# EAGLE design Battery board V4.2 (EAGLE 8.3.1)
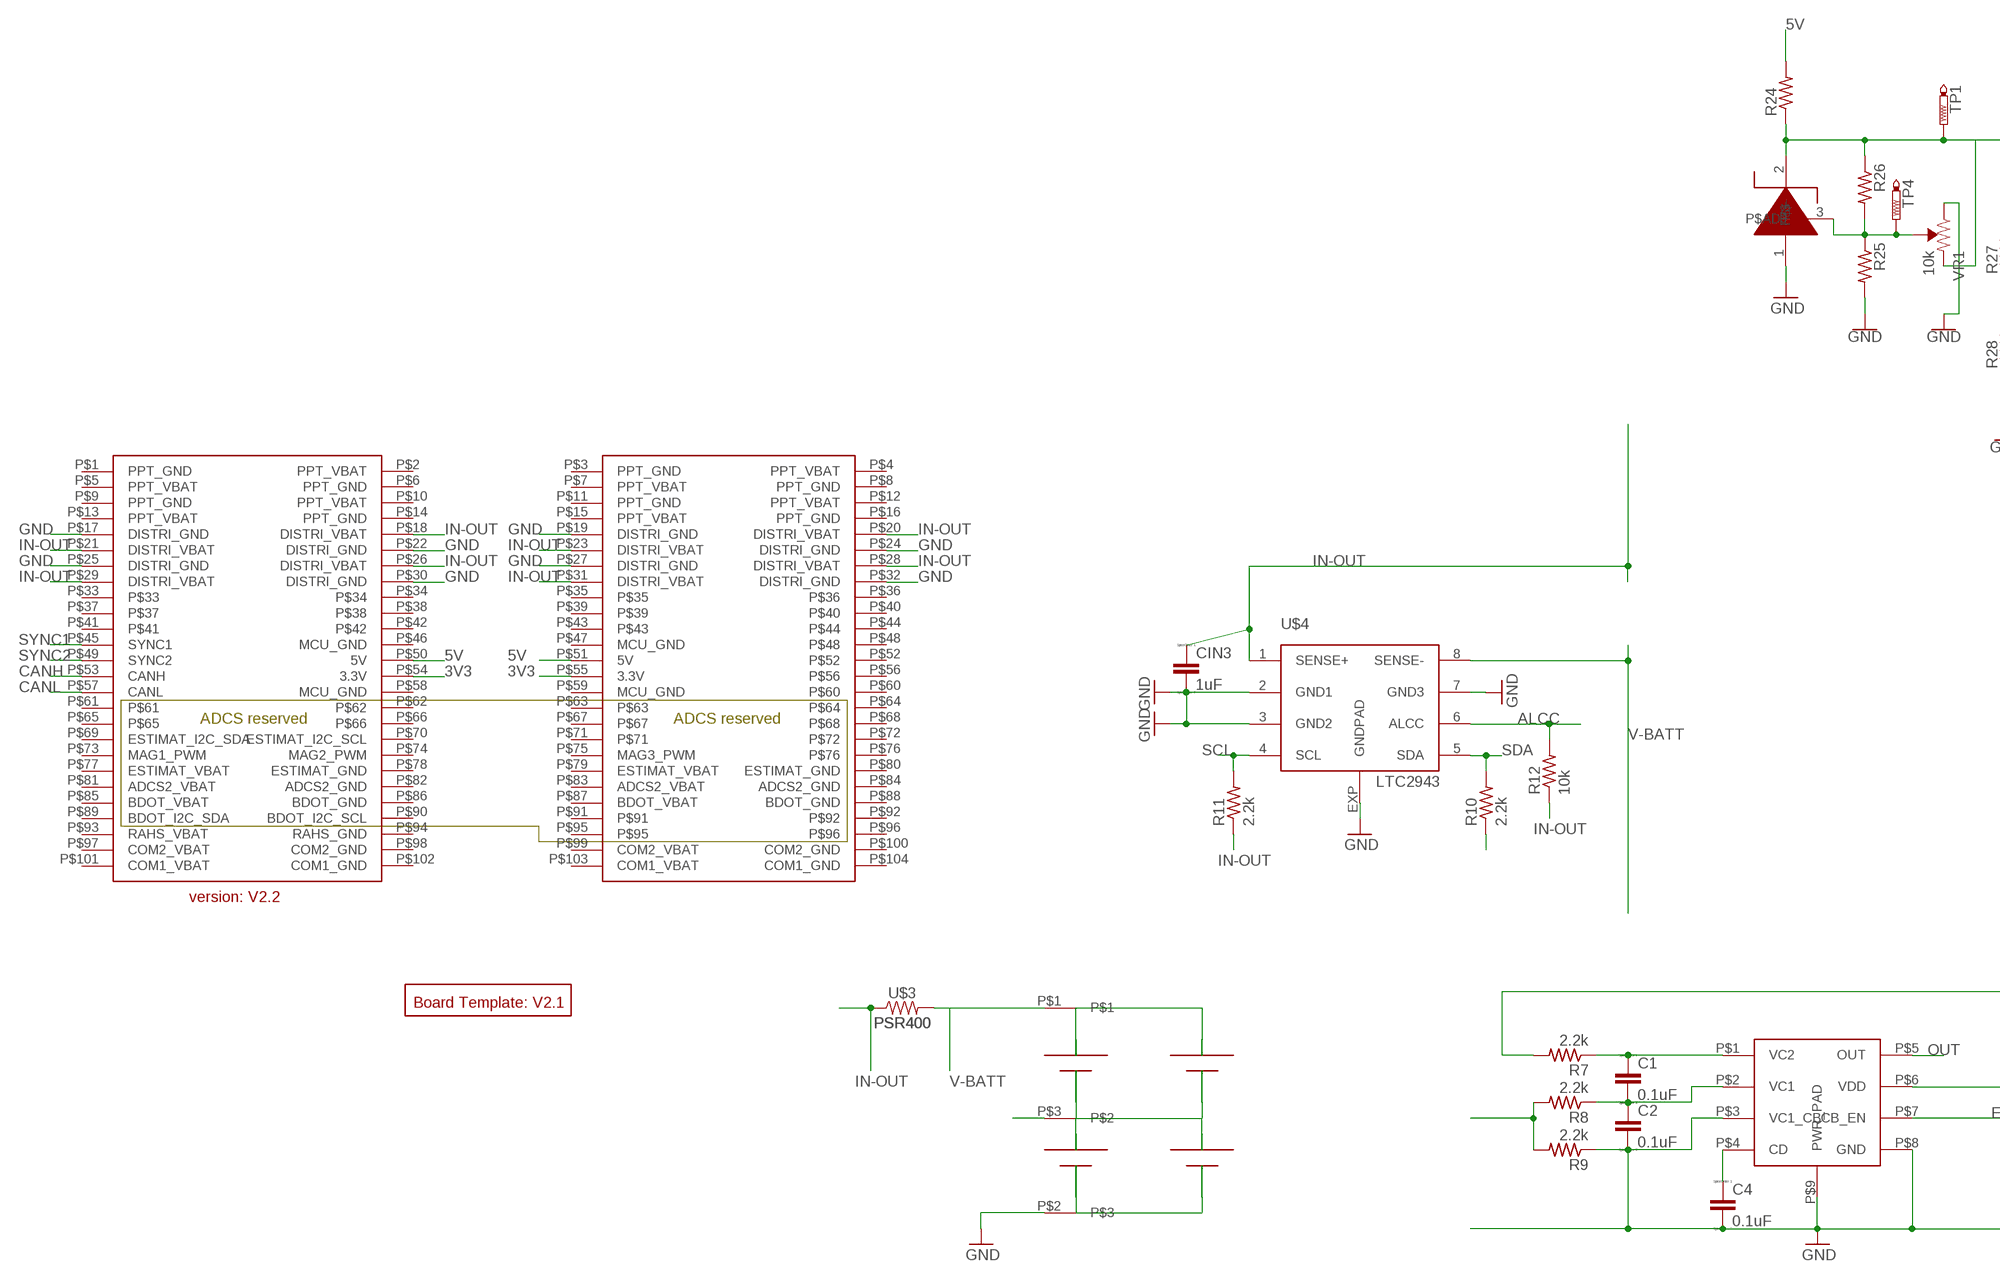
[diagram p0: schematic, sheet 1, part 1 of 2]
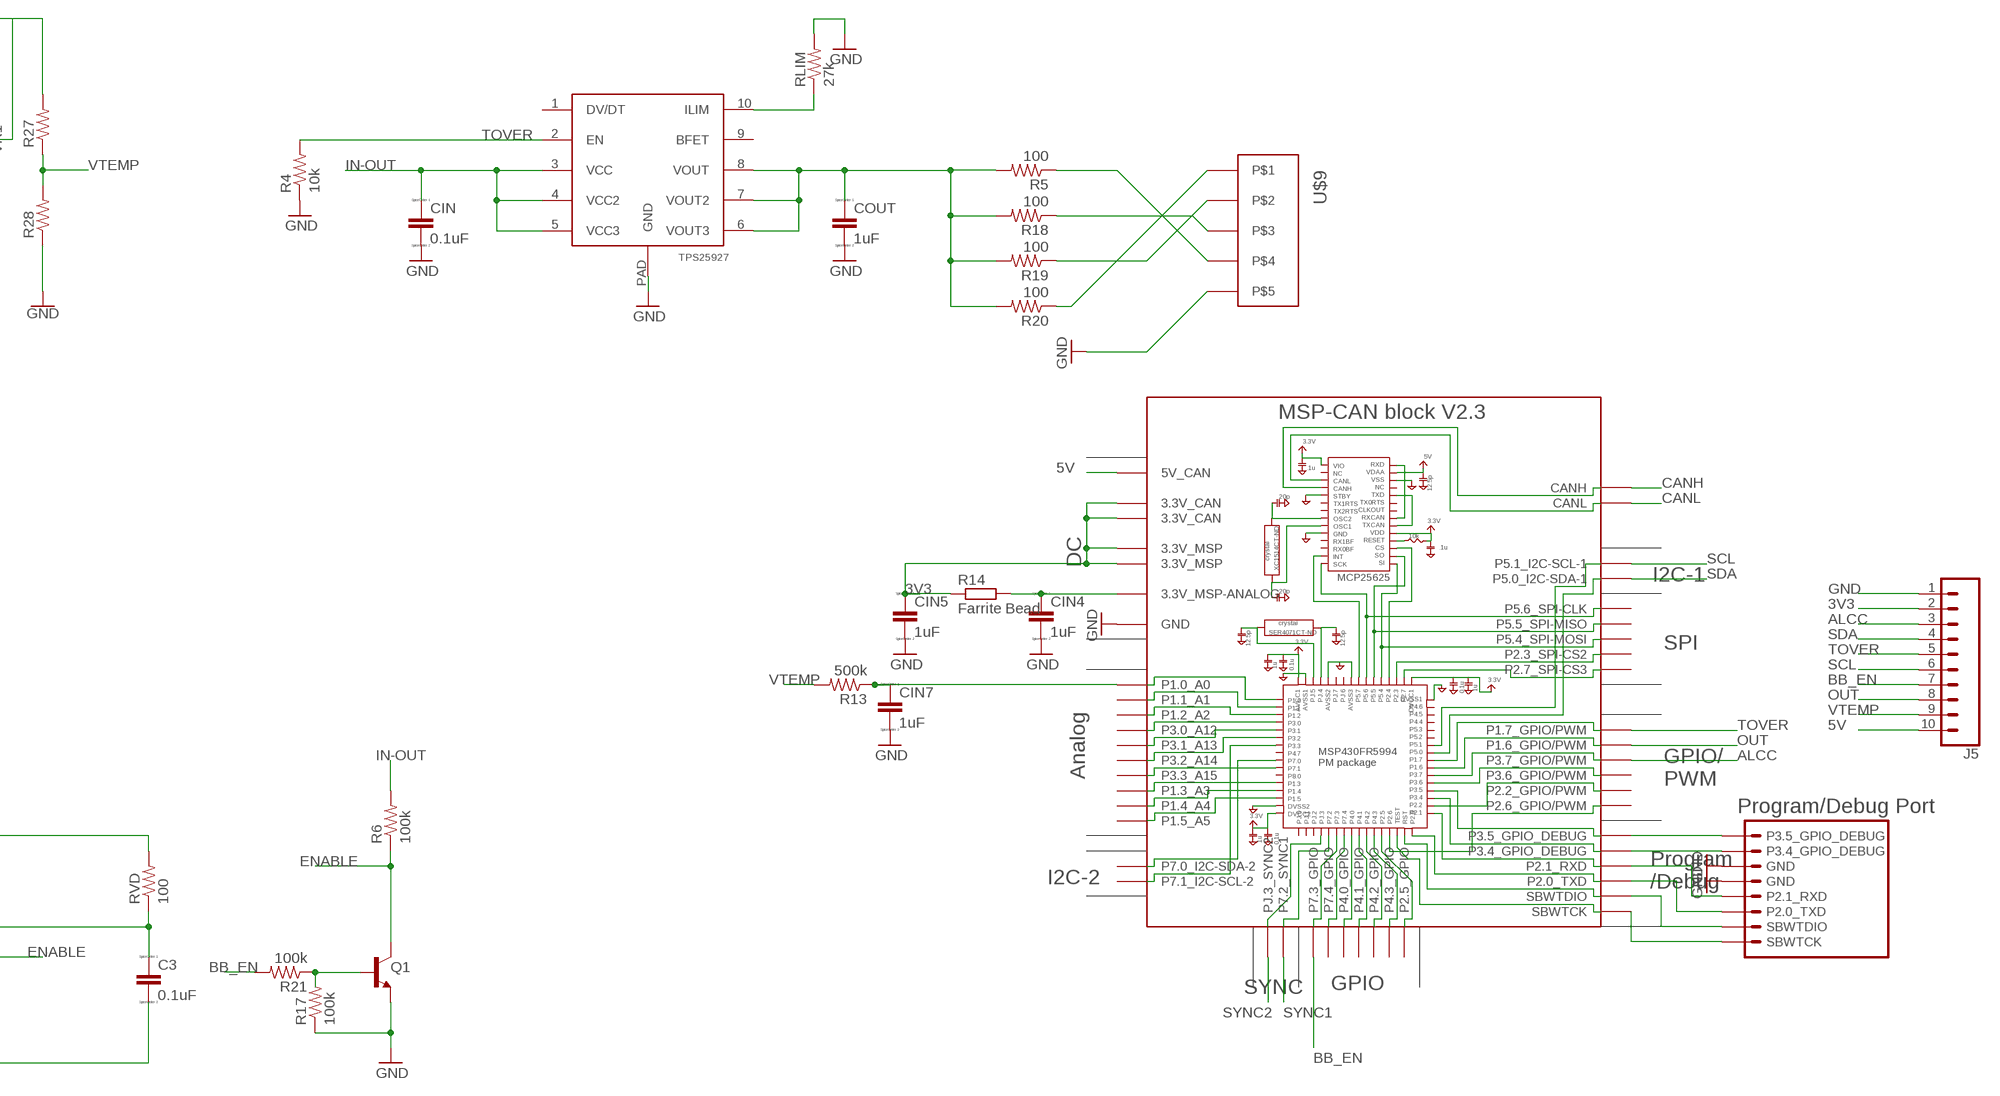
[diagram p1: schematic, sheet 1, part 2 of 2]

## Parts
C1  0.1uF  C  [C0805]
C2  0.1uF  C  [C0805]
C3  0.1uF  C  [C0805]
C4  0.1uF  C  [C0805]
CIN  0.1uF  C  [C0805]
CIN3  1uF  C  [C0805]
CIN4  1uF  C  [C0805]
CIN5  1uF  C  [C0805]
CIN7  1uF  C  [C0805]
COUT  1uF  C  [C0805]
J5  CONN_10LOCK  [1X10_LOCK]
Q1  TRANS_NPN-MMBT2222AL  [SOT23-3]
R4  10k  R-US_R0805  [R0805]
R5  100  R-US_R0805  [R0805]
R6  100k  R-US_R0805  [R0805]
R7  2.2k  R-US_R0805  [R0805]
R8  2.2k  R-US_R0805  [R0805]
R9  2.2k  R-US_R0805  [R0805]
R10  2.2k  R-US_R0805  [R0805]
R11  2.2k  R-US_R0805  [R0805]
R12  10k  R-US_R0805  [R0805]
R13  500k  R-US_R0805  [R0805]
R14  Farrite Bead  R-EU_R1206  [R1206]
R17  100k  R-US_M0805  [M0805]
R18  100  R-US_R0805  [R0805]
R19  100  R-US_R0805  [R0805]
R20  100  R-US_R0805  [R0805]
R21  100k  R-US_M0805  [M0805]
R24  R-US_R0805  [R0805]
R25  R-US_R0805  [R0805]
R26  R-US_R0805  [R0805]
R27  R-US_R0805  [R0805]
R28  R-US_R0805  [R0805]
RLIM  27k  R-US_R0805  [R0805]
RVD  100  R-US_R0805  [R0805]
TP1  PTR1PAD1-13Y  [P1-13Y]
TP4  PTR1PAD1-13Y  [P1-13Y]
U$1  MSP-CAN_BLOCK  [MSP-CAN_BLOCK]
U$2  PROGRAM/DEBUG_PORT  [1X08_CONNECTOR]
U$3  PSR400  [PSR400]
U$4  LTC2943  [DFN8(3X3)LT]
U$5  TPS252927  [VSON10]
U$6  POWER_PACK  [BATTERY_PACK]
U$7  PC104_CONNECTOR  [PC104_CONNECTOR]
U$8  BQ29209  [VSON8]
U$9  PICOLOCK_5  [PICOLOCK_5]
U$10  LM135Z  [TO-92-3]
U$11  BOARD_TEMPLATE  [BOARD_TEMPLATE]
VR1  10k  TRIMPOT-SMD-3MM-OPEN-1/10W-25%  [TRIMPOT-SMD-TC33X]

## Nets
3V3: CIN5.1 J5.2 R14.1 U$1.3.3V@CAN1(3.3V_CAN) U$1.3.3V@CAN2(3.3V_CAN) U$1.3.3V@MSP1(3.3V_MSP) U$1.3.3V@MSP2(3.3V_MSP) U$7.P$54(3.3V) U$7.P$55(3.3V)
5V: J5.10 R24.2 U$1.5V(5V_CAN) U$7.P$50(5V) U$7.P$51(5V)
ALCC: J5.3 R12.2 U$1.P3.7_GPIO/PWM U$4.6(ALCC)
BASE: Q1.1(B) R17.2 R21.1
BB_EN: J5.7 R21.2 U$1.P7.3_GPIO
BT-NODE: R8.2 R9.2 U$6.P$3
CANH: U$1.CANH U$7.P$53(CANH)
CANL: U$1.CANL U$7.P$57(CANL)
ENABLE: Q1.3(C) R6.1 U$8.P$7(CB_EN)
FERRITE-BEAD: CIN4.1 R14.2 U$1.3.3V_ANALOG@MSP2(3.3V_MSP-ANALOG)
GND: C2.2 C3.2 C4.2 CIN3.2 CIN4.2 CIN5.2 CIN7.2 CIN.2 COUT.2 J5.1 Q1.2(E) R4.1 R9.1 R17.1 R25.2 R28.1 RLIM.2 U$1.GND@1(GND) U$1.GND@2(GND) U$1.GND@3(GND) U$1.GND@4(GND) U$1.GND@5(GND) U$1.GND@7(GND) U$1.GND@8(GND) U$1.GND@9(GND) U$1.GND@10(GND) U$1.GND@11(GND) U$1.GND@12(GND) U$1.GND@13(GND) U$1.GND@14(GND) U$1.GND@15(GND) U$1.GND@16(GND) U$1.GND@17(GND) U$1.GND@26(GND) U$2.5(GND) U$2.6(GND) U$4.2(GND1) U$4.3(GND2) U$4.7(GND3) U$4.EXP(GNDPAD) U$5.PAD(GND) U$6.P$2 U$7.P$17(DISTRI_GND) U$7.P$19(DISTRI_GND) U$7.P$22(DISTRI_GND) U$7.P$24(DISTRI_GND) U$7.P$25(DISTRI_GND) U$7.P$27(DISTRI_GND) U$7.P$30(DISTRI_GND) U$7.P$32(DISTRI_GND) U$8.P$3(VC1_CB) U$8.P$8(GND) U$8.P$9(PWR_PAD) U$9.P$5 U$10.1(P$-) VR1.1(CW)
IN-OUT: CIN3.1 CIN.1 R6.2 R7.2 R10.1 R11.1 R12.1 RVD.2 U$3.P$1 U$4.1(SENSE+) U$5.3(VCC) U$5.4(VCC2) U$5.5(VCC3) U$7.P$18(DISTRI_VBAT) U$7.P$20(DISTRI_VBAT) U$7.P$21(DISTRI_VBAT) U$7.P$23(DISTRI_VBAT) U$7.P$26(DISTRI_VBAT) U$7.P$28(DISTRI_VBAT) U$7.P$29(DISTRI_VBAT) U$7.P$31(DISTRI_VBAT)
N$3: R20.1 U$9.P$1
N$4: C1.1 R7.1 U$8.P$1(VC2)
N$5: C1.2 C2.1 R8.1 U$8.P$2(VC1)
N$6: C3.1 RVD.1 U$8.P$6(VDD)
N$8: C4.1 U$8.P$4(CD)
N$9: COUT.1 R5.2 R18.2 R19.2 R20.2 U$5.6(VOUT3) U$5.7(VOUT2) U$5.8(VOUT)
N$10: RLIM.1 U$5.10(ILIM)
N$11: R19.1 U$9.P$2
N$12: R18.1 U$9.P$3
N$14: U$1.P3.5_GPIO_DEBUG U$2.8(P3.5_GPIO_DEBUG)
N$15: U$1.P3.4_GPIO_DEBUG U$2.7(P3.4_GPIO_DEBUG)
N$17: R5.1 U$9.P$4
N$19: U$1.P2.1_RXD U$2.4(P2.1_RXD)
N$20: U$1.P2.0_TXD U$2.3(P2.0_TXD)
N$21: U$1.SBWTDIO U$2.2(SBWTDIO)
N$22: U$1.SBWTCK U$2.SBWTCK
N$23: R24.1 R26.1 R27.2 TP1.TP U$10.2(P$+) VR1.3(CCW)
N$24: R25.1 R26.2 TP4.TP U$10.3(P$ADJ) VR1.2(WIPER)
OUT: J5.8 U$1.P1.6_GPIO/PWM U$8.P$5(OUT)
SCL: J5.6 R11.2 U$1.P5.1_I2C-SCL-1 U$4.4(SCL)
SDA: J5.4 R10.2 U$1.P5.0_I2C-SDA-1 U$4.5(SDA)
SYNC1: U$1.P7.2_SYNC1 U$7.P$45(SYNC1)
SYNC2: U$1.PJ.3_SYNC2 U$7.P$49(SYNC2)
TOVER: J5.5 R4.2 U$1.P1.7_GPIO/PWM U$5.2(EN)
V-BATT: U$3.P$2 U$4.8(SENSE-) U$6.P$1
VTEMP: J5.9 R13.2 R27.1 R28.2
VTEMP_FILTERED: CIN7.1 R13.1 U$1.P1.0_A0
Unconnected: U$1.P1.1_A1 U$1.P1.2_A2 U$1.P1.3_A3 U$1.P1.4_A4 U$1.P1.5_A5 U$1.P2.2_GPIO/PWM U$1.P2.4_SPI-CS2(P2.3_SPI-CS2) U$1.P2.5_GPIO U$1.P2.6_GPIO/PWM U$1.P2.7_SPI-CS3 U$1.P3.0_A12 U$1.P3.1_A13 U$1.P3.2_A14 U$1.P3.3_A15 U$1.P3.6_GPIO/PWM U$1.P4.0_GPIO U$1.P4.1_GPIO U$1.P4.2_GPIO U$1.P4.3_GPIO U$1.P5.4_SPI-MOSI U$1.P5.5_SPI-MISO U$1.P5.6_SPI-CLK U$1.P7.0_I2C-SDA-2 U$1.P7.1_I2C-SCL-2 U$1.P7.4_GPIO U$5.1(DV/DT) U$5.9(BFET) U$7.P$1(PPT_GND) U$7.P$2(PPT_VBAT) U$7.P$3(PPT_GND) U$7.P$4(PPT_VBAT) U$7.P$5(PPT_VBAT) U$7.P$6(PPT_GND) U$7.P$7(PPT_VBAT) U$7.P$8(PPT_GND) U$7.P$9(PPT_GND) U$7.P$10(PPT_VBAT) U$7.P$11(PPT_GND) U$7.P$12(PPT_VBAT) U$7.P$13(PPT_VBAT) U$7.P$14(PPT_GND) U$7.P$15(PPT_VBAT) U$7.P$16(PPT_GND) U$7.P$33 U$7.P$34 U$7.P$35 U$7.P$36 U$7.P$37 U$7.P$38 U$7.P$39 U$7.P$40 U$7.P$41 U$7.P$42 U$7.P$43 U$7.P$44 U$7.P$46(MCU_GND) U$7.P$47(MCU_GND) U$7.P$48 U$7.P$52 U$7.P$56 U$7.P$58(MCU_GND) U$7.P$59(MCU_GND) U$7.P$60 U$7.P$61 U$7.P$62 U$7.P$63 U$7.P$64 U$7.P$65 U$7.P$66 U$7.P$67 U$7.P$68 U$7.P$69(ESTIMAT_I2C_SDA) U$7.P$70(ESTIMAT_I2C_SCL) U$7.P$71 U$7.P$72 U$7.P$73(MAG1_PWM) U$7.P$74(MAG2_PWM) U$7.P$75(MAG3_PWM) U$7.P$76 U$7.P$77(ESTIMAT_VBAT) U$7.P$78(ESTIMAT_GND) U$7.P$79(ESTIMAT_VBAT) U$7.P$80(ESTIMAT_GND) U$7.P$81(ADCS2_VBAT) U$7.P$82(ADCS2_GND) U$7.P$83(ADCS2_VBAT) U$7.P$84(ADCS2_GND) U$7.P$85(BDOT_VBAT) U$7.P$86(BDOT_GND) U$7.P$87(BDOT_VBAT) U$7.P$88(BDOT_GND) U$7.P$89(BDOT_I2C_SDA) U$7.P$90(BDOT_I2C_SCL) U$7.P$91 U$7.P$92 U$7.P$93(RAHS_VBAT) U$7.P$94(RAHS_GND) U$7.P$95 U$7.P$96 U$7.P$97(COM2_VBAT) U$7.P$98(COM2_GND) U$7.P$99(COM2_VBAT) U$7.P$100(COM2_GND) U$7.P$101(COM1_VBAT) U$7.P$102(COM1_GND) U$7.P$103(COM1_VBAT) U$7.P$104(COM1_GND)

## Library data of the parts
C1-C4 CIN CIN3-CIN5 CIN7 COUT = eagle-ltspice:C: CAPACITOR, European symbol; SPICEMODEL: NONE; SPICEPREFIX: C
J5 = DubSat1 Components:CONN_10: Multi connection point. Often used as Generic Header-pin footprint for 0.1 inch spaced/style header connections On any of the 0.1 inch spaced packages, you can populate with these: Break Away Headers - Straight <https://www.sparkfun.com/products/116> (PRT-00116) Break Away Male Headers - Right Angle <https://www.sparkfun.com/products/553> (PRT-00553) Female Headers <https://www.sparkfun.com/products/115> (PRT-00115) Break Away Headers - Machine Pin <https://www.sparkfun.com/products/117> (PRT-00117) Break Away Female Headers - Swiss Machine Pin <https://www.sparkfun.com/products/743> (PRT-00743) Arduino Stackable Header - 10 Pin <https://www.sparkfun.com/products/11376> (PRT-11376) For SCREWTERMINALS and SPRING TERMINALS visit here: Screw Terimnals on SparkFun.com <https://www.sparkfun.com/search/results?term=Screw+Terminals> (5mm/3.5mm/2.54mm spacing) This device is also useful as a general connection point to wire up your design to another part of your project. Our various solder wires solder well into these plated through hole pads. Hook-Up Wire - Assortment (Stranded, 22 AWG) <https://www.sparkfun.com/products/11375> (PRT-11375) Hook-Up Wire - Assortment (Solid Core, 22 AWG) <https://www.sparkfun.com/products/11367> (PRT-11367) View the entire wire category on our website here <https://www.sparkfun.com/categories/141> Special notes: Molex polarized connector foot print use with SKU : PRT-08231 with associated crimp pins and housings. 1MM SMD Version SKU: PRT-10208 NOTES ON THE VARIANTS LOCK and LOCK_LONGPADS... This footprint was designed to help hold the alignment of a through-hole component (i.e. 6-pin header) while soldering it into place. You may notice that each hole has been shifted either up or down by 0.005 of an inch from it's more standard position (which is a perfectly straight line). This slight alteration caused the pins (the squares in the middle) to touch the edges of the holes. Because they are alternating, it causes a "brace" to hold the component in place. 0.005 has proven to be the perfect amount of "off-center" position when using our standard breakaway headers. Although looks a little odd when you look at the bare footprint, once you have a header in there, the alteration is very hard to notice. Also,if you push a header all the way into place, it is covered up entirely on the bottom side.
Q1 = SparkFun-DiscreteSemi:TRANS_NPN: NPN transistor Current controlled devices typically used to amplify current or used as a switch. BC547 - COM-08928 <http://www.sparkfun.com/products/8928> (TO-92 45V 100mA) (1.Collector 2.Base 3.Emitter) 2N3904 - COM-00521 <http://www.sparkfun.com/products/521> (TO-92 40V 200mA) (1.Emitter 2.Base 3.Collector) P2N2222A - COM-12852 <http://www.sparkfun.com/products/12852> (TO-92 40V 600mA) (1.Collector 2.Base 3.Emitter); PROD_ID: TRANS-08049; VALUE: 600mA/40V
R4-R13 R17-R21 R24-R28 RLIM RVD = rcl:R-US_: RESISTOR, American symbol
R14 = rcl:R-EU_: RESISTOR, European symbol
TP1 TP4 = testpad:PTR1: TEST PIN
U$1 = CubeSat(V2.2) (2):MSP-CAN_BLOCK
U$2 = DubSat1 Components:PROGRAM/DEBUG_PORT
U$3 = Parts for Power Team1:PSR400
U$4 = Parts for Power Team1:LTC2943
U$5 = Parts for Power Team1:TPS252927: http://www.ti.com/product/tps25927/datasheet
U$6 = DubSat1 Components:POWER_PACK
U$7 = DubSat1 Components:PC104_CONNECTOR
U$8 = Parts for Power Team1:BQ29209
U$9 = DubSat1 Components:PICOLOCK_5
U$10 = DubSat1 Components:LM135Z: Mounted temp sensor Datasheet: http://www.ti.com/lit/ds/symlink/lm235a.pdf Unique linear output of Voltage vs temperature. 10mv per degree kelvin E.g: 3v = 300 degree kelvin.
U$11 = DubSat1 Components:BOARD_TEMPLATE
VR1 = DubSat1 Components:TRIMPOT: Trimming Potentiometer (Trimpot) Three-terminal potentiometers, with an adjustable wiper and two adjustable resistors. A pot can be used to create a configurable voltage divider, or as a variable resistor. "Trimpots" are a subset of potentiometers, usually intended for "set-and-forget" applications. They're often more delicate than standard potentiometers - rated for fewer turns. Variants PTH-KNOB - PTH Trimpot w/ finger-adjustable knob Trimpot 10K with Knob <https://www.sparkfun.com/products/9806> (COM-09806) Datasheet <http://www.sparkfun.com/datasheets/Components/General/TSR-3386.pdf> SMD-3MM-CLOSED-FRAME - SMD 3mm Square Closed-Frame Trimpot Used on e.g. EasyDriver - Stepper Motor Driver <https://www.sparkfun.com/products/12779> Datasheet <http://www.bitechnologies.com/pdfs/22.pdf> (22AR10KTR) SMD-5MM - SMD 5mm Square Closed-Frame Trimpot Used on e.g. IOIO-OTG - V2.2 <https://www.sparkfun.com/products/13613> Datasheet <http://www.vishay.com/docs/51008/ts53.pdf> (TS53YL502MR10) SMD-3MM-1/10W-25% - 3mm Square Open-Frame Trimpot Used on e.g. SparkFun Shapeoko <https://www.sparkfun.com/products/13899> Datasheet <http://www.bourns.com/docs/Product-Datasheets/TC33.pdf> (TC33X-2-103E); PROD_ID: RES-12428

## Board
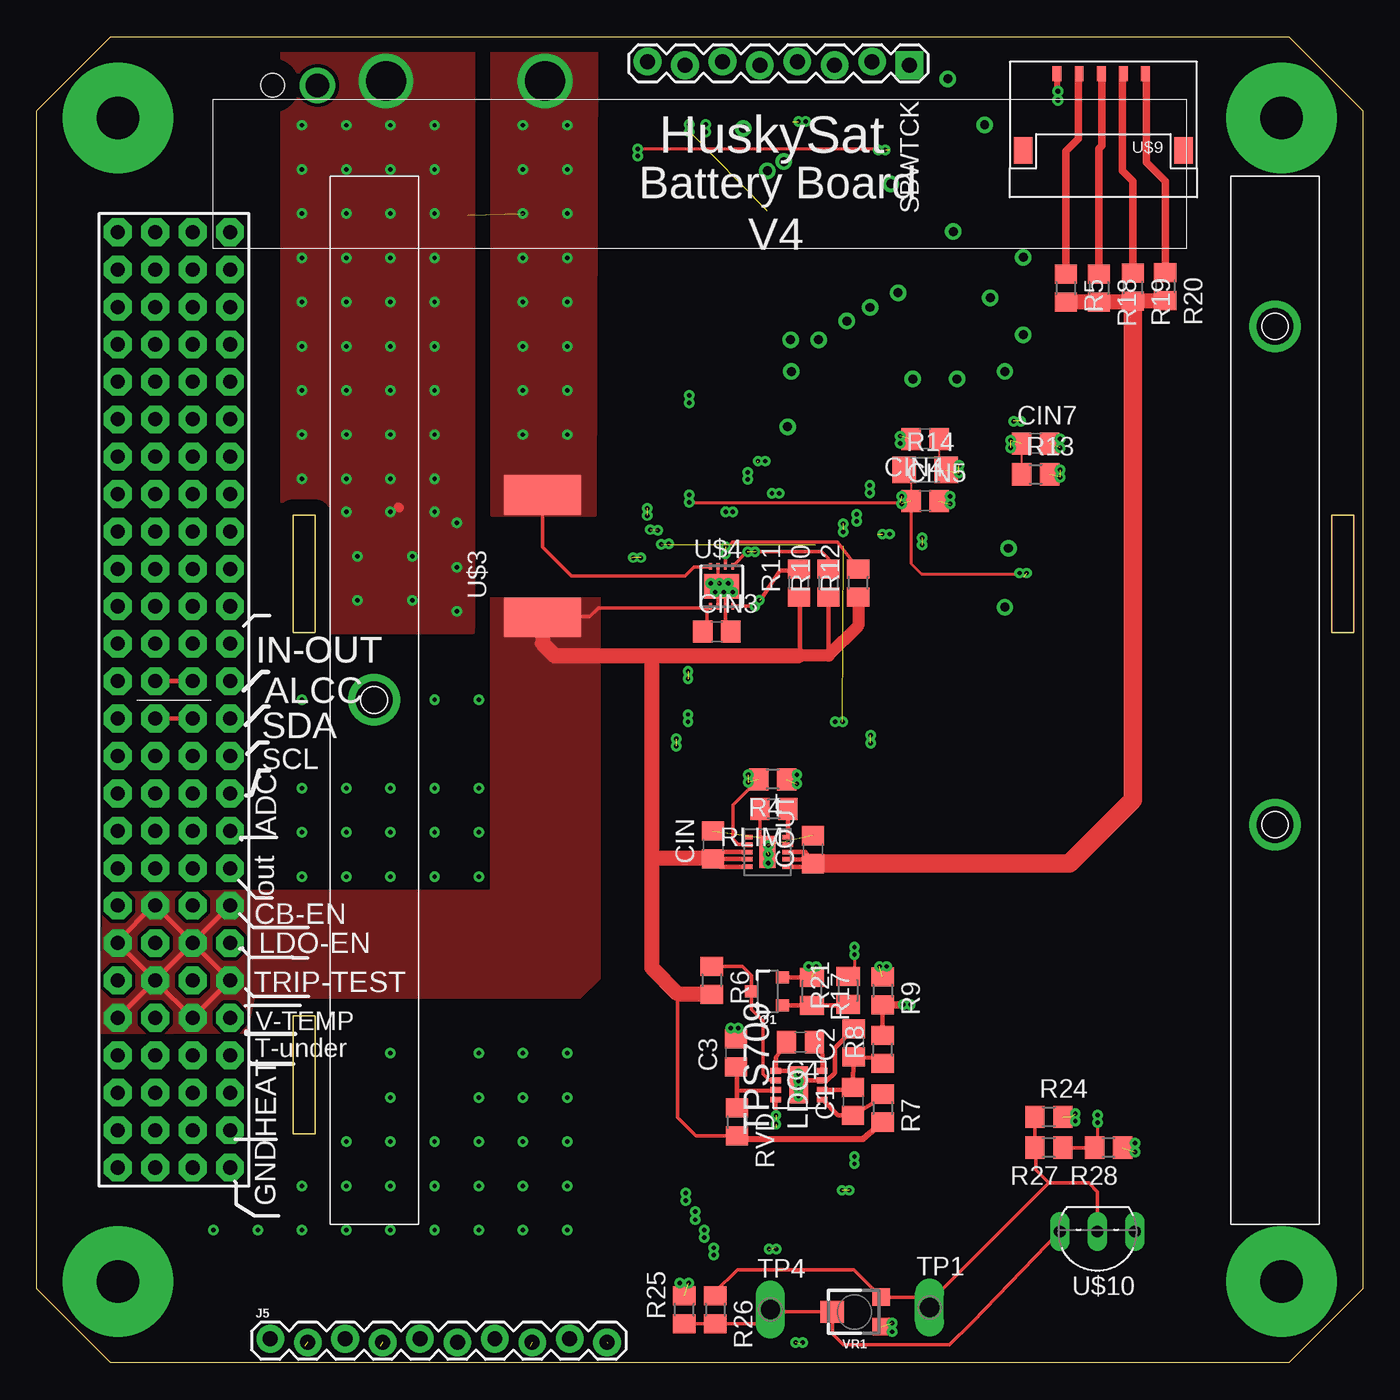
[diagram p2: board, top side]
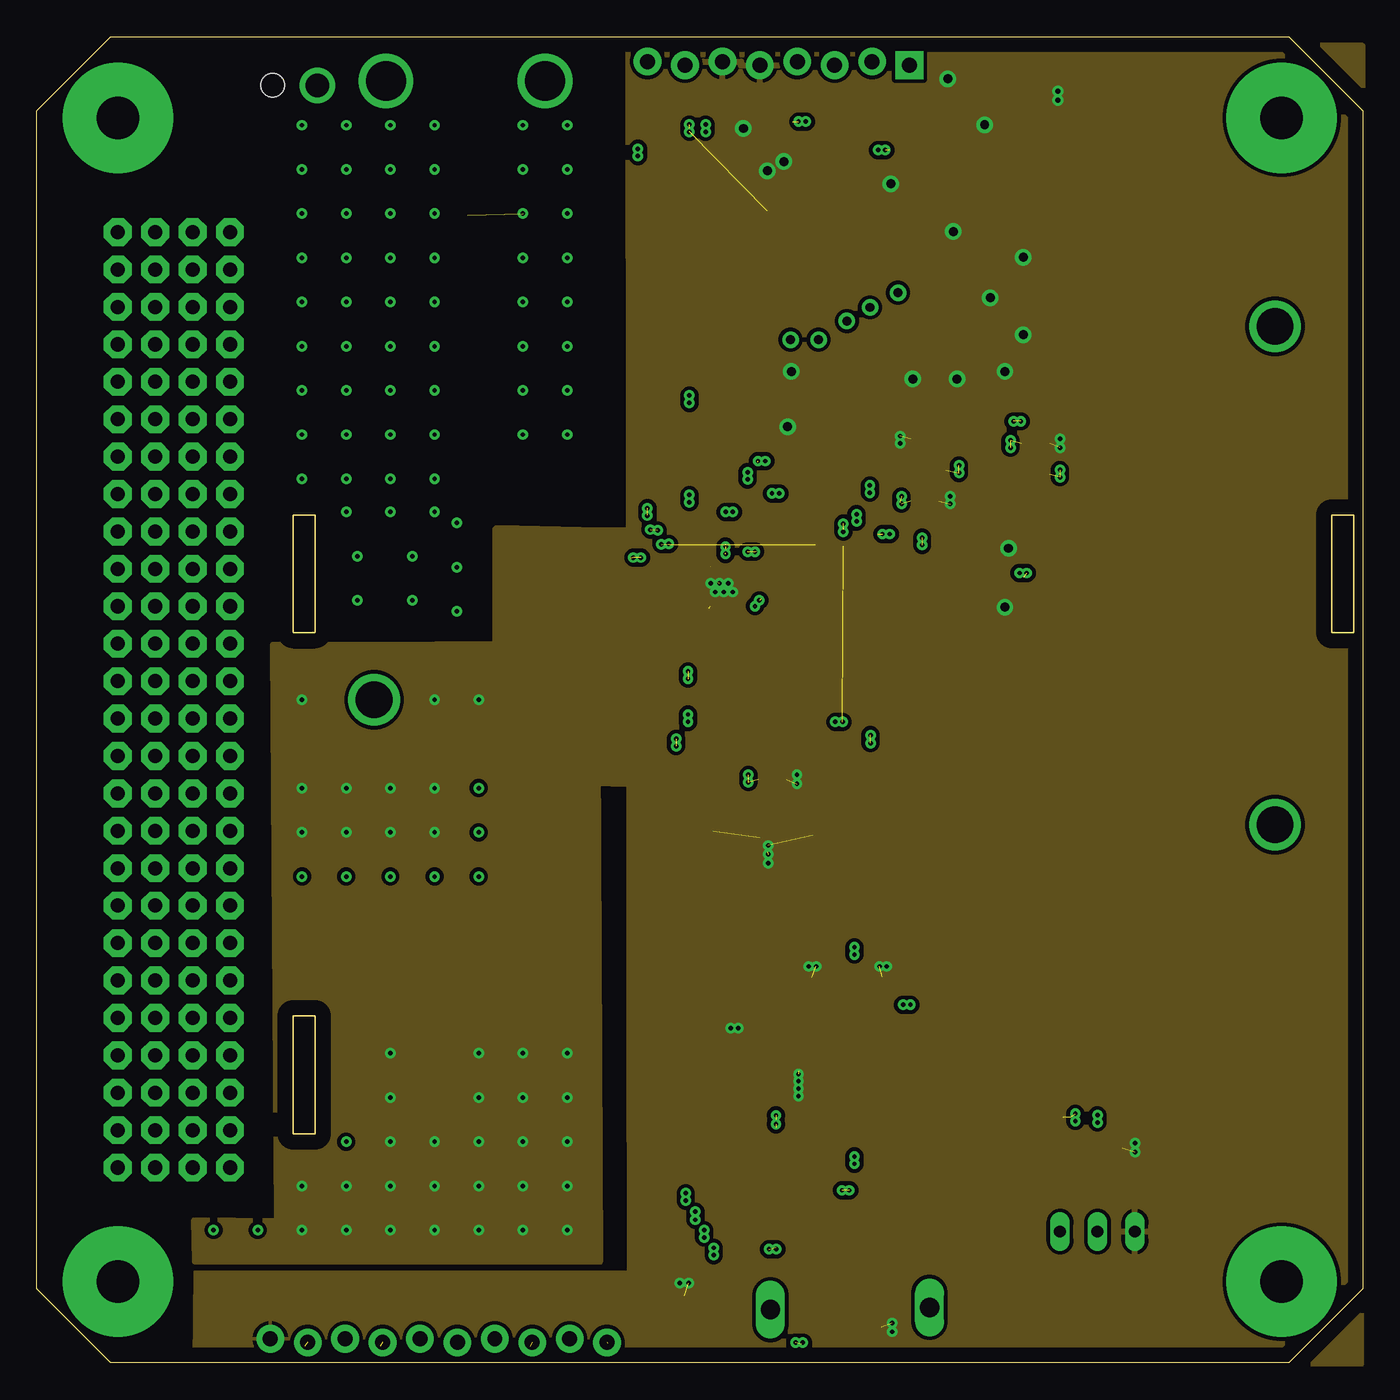
[diagram p3: board, inner layer Route2]
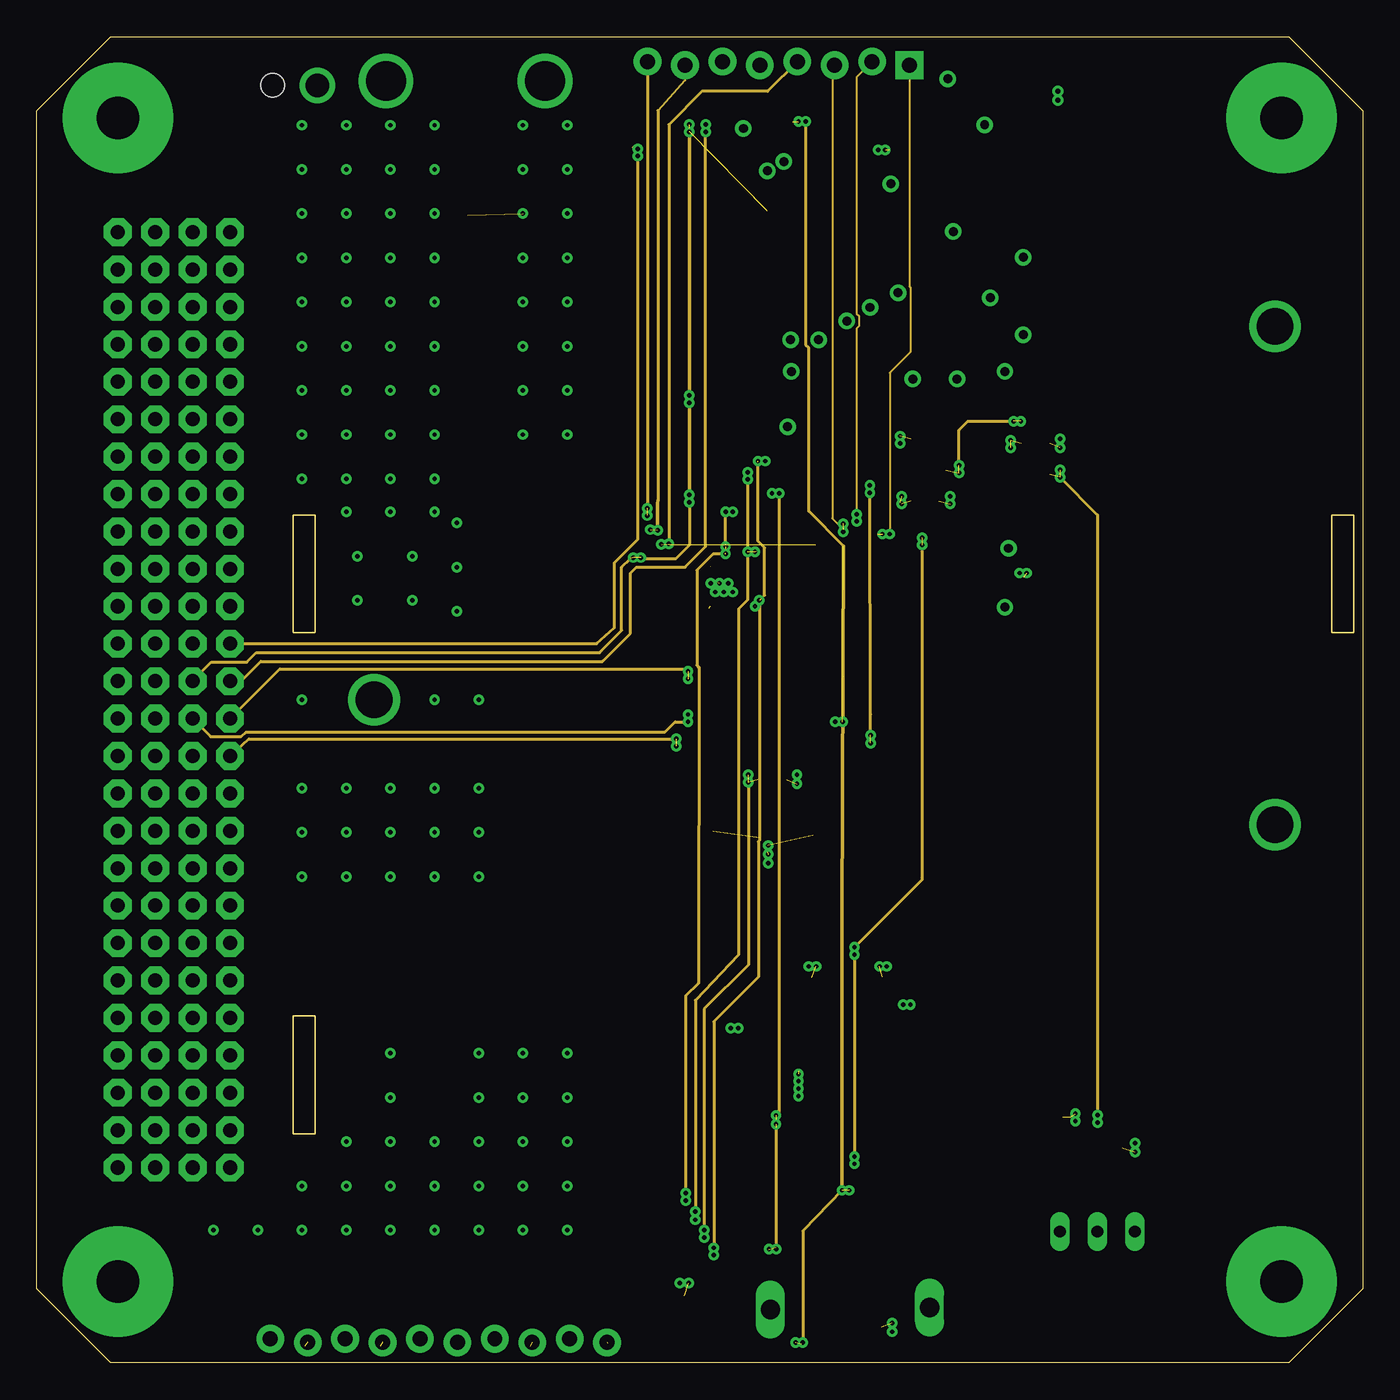
[diagram p4: board, inner layer Route15]
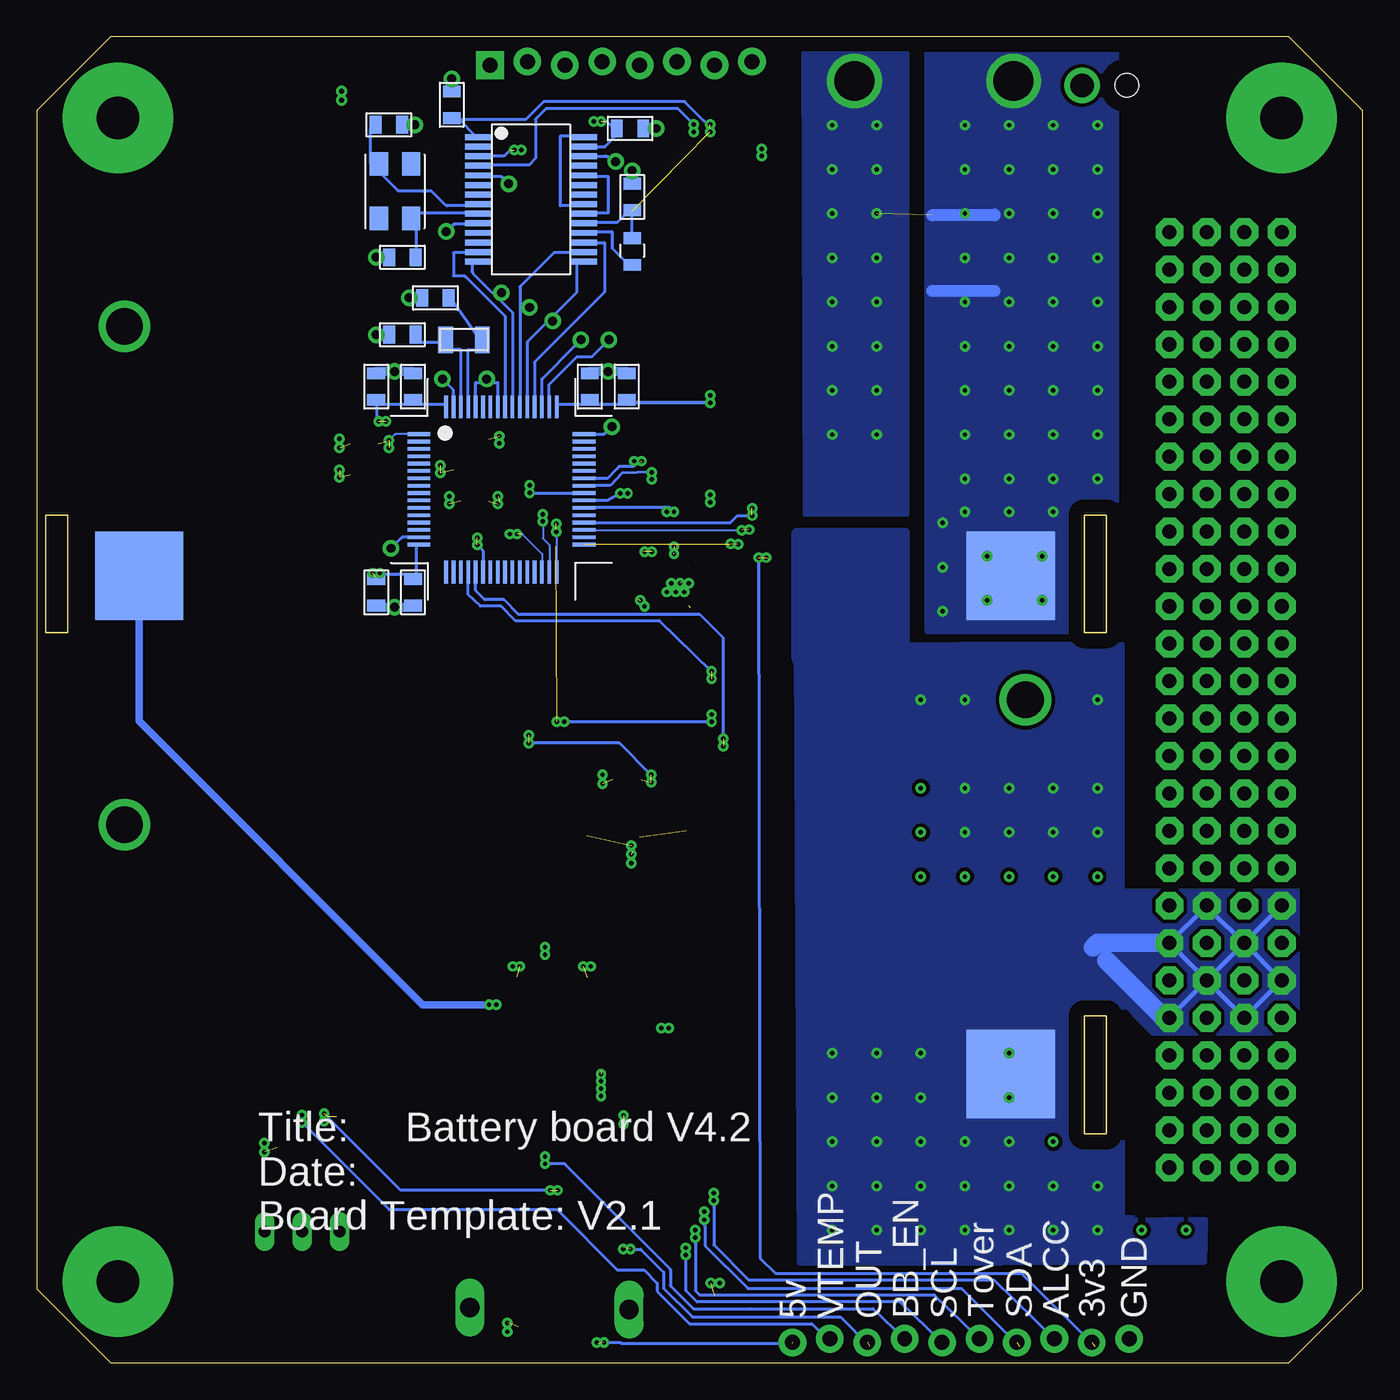
[diagram p5: board, bottom side, seen from below]

Size 90 x 90 mm. Coordinates in mm from the lower left corner, seen from the top.
Copper layers (1*2*15*16): Top 0.035mm / dielectric 0.5mm / Route2 0.035mm / dielectric 0.5mm / Route15 0.035mm / dielectric 0.5mm / Bottom 0.035mm
Design rules "default *": minimum track width 10mil, minimum drill 24mil, track to track 10mil, track to pad 8mil, pad to pad 8mil, via to via 8mil, smd to smd 8mil, copper to edge 40mil, drill to drill 8mil, minimum pad ring 10mil, minimum via ring 8mil, stop-mask expansion 4mil, vias tented up to drill 0mil, thermal gap 10mil
Holes 1.6 mm at 16,86.7

### Footprints (pad centres in the part's own frame; a part is rotated, then mirrored left to right if it is on the bottom)
C0805 = smd 1.3 x 1.5: 1 -0.95,0; 2 0.95,0
1X10_LOCK = drill 1.016 pad 1.88: 1 0,0.127; 2 2.54,-0.127; 3 5.08,0.127; 4 7.62,-0.127; 5 10.16,0.127; 6 12.7,-0.127; 7 15.24,0.127; 8 17.78,-0.127; 9 20.32,0.127; 10 22.86,-0.127
SOT23-3 = smd 0.8 x 0.9: 1 -0.95,-1; 2 0.95,-1; 3 0,1.1
R0805 = smd 1.3 x 1.5: 1 -0.95,0; 2 0.95,0
R1206 = smd 1.6 x 1.803: 1 -1.422,0; 2 1.422,0
M0805 = smd 1.3 x 1.6: 1 -0.95,0; 2 0.95,0
P1-13Y = drill 1.321 pad 1.905 long: TP 0,0
MSP-CAN_BLOCK = smd 1.2 x 0.8: 1 -6,6.08; 2 -6,7.88; 3 -8.5,6.08; 4 -8.5,7.88; 9 -8.5,-6.08; 10 -8.5,-7.88; 11 -6,-6.08; 12 -6,-7.88; 13 8.5,6.08; 14 8.5,7.88; 15 6,6.08; 16 6,7.88; 23 8.875,18.955; 24 8.875,20.755; 25 8.875,17.045; 26 8.875,15.245; 27 -3.375,25.205; 28 -3.375,27.005 | smd 1 x 0.25: 3.3V@CAN1 -3.375,25.125; 3.3V@CAN2 8.875,18.875; 3.3V@MSP1 8.501,5.884; 3.3V@MSP2 -8.533,-5.962; 3.3V_ANALOG@MSP2 -8.482,5.904 | smd 0.8 x 1.2: 5 -5.83,10.5; 6 -7.63,10.5; 7 -3.58,13; 8 -5.38,13; 17 -8.545,24.75; 18 -6.745,24.75; 19 -5.83,15.75; 20 -7.63,15.75; 21 7.83,24.5; 22 9.63,24.5 | smd 0.25 x 1: 5V 7.65,24.5 | smd 1.75 x 0.4: CANH -1.6,21.96; CANL -1.6,22.61; P$65 -1.6,23.91; P$66 -1.6,23.26; P$69 -1.6,21.31; P$70 -1.6,20.66; P$71 -1.6,20.01; P$72 -1.6,19.36; P$73 -1.6,18.71; P$74 -1.6,18.06; P$75 -1.6,17.41; P$76 -1.6,16.76; P$77 -1.6,16.11; P$78 -1.6,15.46; P$79 5.6,15.46; P$80 5.6,16.11; P$81 5.6,16.76; P$82 5.6,17.41; P$83 5.6,18.06; P$84 5.6,18.71; P$85 5.6,19.36; P$86 5.6,20.01; P$87 5.6,20.66; P$88 5.6,21.31; P$89 5.6,21.96; P$90 5.6,22.61; P$91 5.6,23.26; P$92 5.6,23.91 | drill 0.61: GND@1 -3.375,27.875; GND@2 -5.875,24.75; GND@3 -3.75,17.5; GND@4 0.5,20.75; GND@5 -8.5,15.75; GND@7 -8.5,10.5; GND@8 -7.25,8; GND@9 -4,7.5; GND@10 -1,7.5; GND@11 7.75,22.25; GND@12 10.5,24.5; GND@13 8.875,21.625; GND@14 7.25,8; GND@15 7.5,4.25; GND@16 -7.5,-4; GND@17 -7.25,-8; GND@26 -6.25,13; P2.4_SPI-CS2 5.397,10.16; P2.7_SPI-CS3 7.303,10.16; P5.4_SPI-MOSI 3.487,11.434; P5.5_SPI-MISO 1.9,12.354; P5.6_SPI-CLK 0,13.348 | smd 1.55 x 0.25: P1.0_A0 -5.6,3.75; P1.1_A1 -5.6,3.25; P1.2_A2 -5.6,2.75; P1.3_A3 -5.6,-1.75; P1.4_A4 -5.6,-2.25; P1.5_A5 -5.6,-2.75; P1.6_GPIO/PWM 5.6,-0.75; P1.7_GPIO/PWM 5.6,-0.25; P2.1_RXD 5.6,-3.75; P2.2_GPIO/PWM 5.6,-3.25; P3.0_A12 -5.6,2.25; P3.1_A13 -5.6,1.75; P3.2_A14 -5.6,1.25; P3.3_A15 -5.6,0.75; P3.4_GPIO_DEBUG 5.6,-2.75; P3.5_GPIO_DEBUG 5.6,-2.25; P3.6_GPIO/PWM 5.6,-1.75; P3.7_GPIO/PWM 5.6,-1.25; P5.0_I2C-SDA-1 5.6,0.25; P5.1_I2C-SCL-1 5.6,0.75; P7.0_I2C-SDA-2 -5.6,-0.25; P7.1_I2C-SCL-2 -5.6,-0.75; P$8 -5.6,0.25; P$11 -5.6,-1.25; P$15 -5.6,-3.25; P$16 -5.6,-3.75; P$43 5.6,1.25; P$44 5.6,1.75; P$45 5.6,2.25; P$46 5.6,2.75; P$47 5.6,3.25; P$48 5.6,3.75 | smd 0.25 x 1.55: P2.0_TXD 3.75,-5.6; P2.5_GPIO 1.75,-5.6; P2.6_GPIO/PWM 2.25,-5.6; P4.0_GPIO -0.25,-5.6; P4.1_GPIO 0.25,-5.6; P4.2_GPIO 0.75,-5.6; P4.3_GPIO 1.25,-5.6; P7.2_SYNC1 -1.75,-5.6; P7.3_GPIO -1.25,-5.6; P7.4_GPIO -0.75,-5.6; P$17 -3.75,-5.6; P$18 -3.25,-5.6; P$19 -2.75,-5.6; P$49 3.75,5.6; P$50 3.25,5.6; P$51 2.75,5.6; P$52 2.25,5.6; P$53 1.75,5.6; P$54 1.25,5.6; P$55 0.75,5.6; P$56 0.25,5.6; P$57 -0.25,5.6; P$58 -0.75,5.6; P$59 -1.25,5.6; P$60 -1.75,5.6; P$61 -2.25,5.6; P$62 -2.75,5.6; P$63 -3.25,5.6; P$64 -3.75,5.6; PJ.3_SYNC2 -2.25,-5.6; SBWTCK 2.75,-5.6; SBWTDIO 3.25,-5.6 | smd 1 x 1.8: P$93 -3.79,10.16; P$94 -1.29,10.16 | smd 1.25 x 1.6: P$104 -6.13,18.38; P$105 -6.13,22.08; P$106 -8.33,22.08; P$107 -8.33,18.38
1X08_CONNECTOR = drill 1.016 pad 1.88: 2 2.54,-0.127; 3 5.08,0.127; 4 7.62,-0.127; 5 10.16,0.127; 6 12.7,-0.127; 7 15.24,0.127; 8 17.78,-0.127 | drill 1.016 pad 1.88 square: SBWTCK 0,0.127
PSR400 = smd 2.7 x 5.2: P$1 0,0; P$2 8.3,0
DFN8(3X3)LT = smd 0.25 x 0.45: 1 -2.02,-0.08; 2 -1.52,-0.08; 3 -1.02,-0.08; 4 -0.52,-0.08; 5 -0.52,2.62; 6 -1.02,2.62; 7 -1.52,2.62; 8 -2.02,2.62 | smd 2.38 x 1.65: EXP -1.27,1.27
VSON10 = smd 0.7 x 0.305: 1 0.2,2.575; 2 0.2,2.075; 3 0.2,1.575; 4 0.2,1.075; 5 0.2,0.575; 6 2.95,0.575; 7 2.95,1.075; 8 2.95,1.575; 9 2.95,2.075; 10 2.95,2.575 | smd 1.067 x 2.184: PAD 1.575,1.575
BATTERY_PACK = smd 6 x 6 bottom: P$1 27.13,-2; P$2 60.95,-2; P$3 27.13,57.15
PC104_CONNECTOR = drill 0.953 pad 1.88 octagon: P$1 -31.75,31.88; P$2 -31.75,34.42; P$3 -31.75,36.96; P$4 -31.75,39.5; P$5 -29.21,31.88; P$6 -29.21,34.42; P$7 -29.21,36.96; P$8 -29.21,39.5; P$9 -26.67,31.88; P$10 -26.67,34.42; P$11 -26.67,36.96; P$12 -26.67,39.5; P$13 -24.13,31.88; P$14 -24.13,34.42; P$15 -24.13,36.96; P$16 -24.13,39.5; P$17 -21.59,31.88; P$18 -21.59,34.42; P$19 -21.59,36.96; P$20 -21.59,39.5; P$21 -19.05,31.88; P$22 -19.05,34.42; P$23 -19.05,36.96; P$24 -19.05,39.5; P$25 -16.51,31.88; P$26 -16.51,34.42; P$27 -16.51,36.96; P$28 -16.51,39.5; P$29 -13.97,31.88; P$30 -13.97,34.42; P$31 -13.97,36.96; P$32 -13.97,39.5; P$33 -11.43,31.88; P$34 -11.43,34.42; P$35 -11.43,36.96; P$36 -11.43,39.5; P$37 -8.89,31.88; P$38 -8.89,34.42; P$39 -8.89,36.96; P$40 -8.89,39.5; P$41 -6.35,31.88; P$42 -6.35,34.42; P$43 -6.35,36.96; P$44 -6.35,39.5; P$45 -3.81,31.88; P$46 -3.81,34.42; P$47 -3.81,36.96; P$48 -3.81,39.5; P$49 -1.27,31.88; P$50 -1.27,34.42; P$51 -1.27,36.96; P$52 -1.27,39.5; P$53 1.27,31.88; P$54 1.27,34.42; P$55 1.27,36.96; P$56 1.27,39.5; P$57 3.81,31.88; P$58 3.81,34.42; P$59 3.81,36.96; P$60 3.81,39.5; P$61 6.35,31.88; P$62 6.35,34.42; P$63 6.35,36.96; P$64 6.35,39.5; P$65 8.89,31.88; P$66 8.89,34.42; P$67 8.89,36.96; P$68 8.89,39.5; P$69 11.43,31.88; P$70 11.43,34.42; P$71 11.43,36.96; P$72 11.43,39.5; P$73 13.97,31.88; P$74 13.97,34.42; P$75 13.97,36.96; P$76 13.97,39.5; P$77 16.51,31.88; P$78 16.51,34.42; P$79 16.51,36.96; P$80 16.51,39.5; P$81 19.05,31.88; P$82 19.05,34.42; P$83 19.05,36.96; P$84 19.05,39.5; P$85 21.59,31.88; P$86 21.59,34.42; P$87 21.59,36.96; P$88 21.59,39.5; P$89 24.13,31.88; P$90 24.13,34.42; P$91 24.13,36.96; P$92 24.13,39.5; P$93 26.67,31.88; P$94 26.67,34.42; P$95 26.67,36.96; P$96 26.67,39.5; P$97 29.21,31.88; P$98 29.21,34.42; P$99 29.21,36.96; P$100 29.21,39.5; P$101 31.75,31.88; P$102 31.75,34.42; P$103 31.75,36.96; P$104 31.75,39.5
VSON8 = smd 0.4 x 0.7: P$1 0,0; P$2 0.65,0; P$3 1.3,0; P$4 1.95,0; P$5 0,3.15; P$6 0.65,3.15; P$7 1.3,3.15; P$8 1.95,3.15 | smd 2.54 x 1.27: P$9 1,1.6
PICOLOCK_5 = smd 1.25 x 1.8: MNT@1 -2.605,5.2; MNT@2 8.305,5.2 | smd 0.6 x 1: P$1 0,0; P$2 1.5,0; P$3 3,0; P$4 4.5,0; P$5 6,0
TO-92-3 = drill 0.813 long: 1 -2.54,0; 2 0,0; 3 2.54,0
BOARD_TEMPLATE = drill 2.9 pad 7.5: P$1 -39.5,39.5; P$2 -39.5,-39.5; P$3 39.5,-39.5; P$4 39.5,39.5
TRIMPOT-SMD-TC33X = smd 1.2 x 1.2: 1 -1,-1.825; 3 1,-1.825 | smd 1.5 x 1.6: 2 0,1.5

### Placement (x,y rotation side)
C1  55.41,17.74 90 top
C2  55.45,21.71 90 top
C3  47.46,21.04 90 top
C4  51.85,21.76 180 top
CIN  45.9,35.14 90 top
CIN3  46.15,49.62 0 top
CIN4  60.3,62.7 180 top
CIN5  60.3,58.5 0 top
CIN7  67.8,62.4 0 top
COUT  52.68,34.82 90 top
J5  15.85,1.5 0 top
Q1  49.62,25.21 90 top
R4  49.95,39.6 180 top
R5  69.84,72.94 270 top
R6  45.82,25.96 270 top
R7  57.42,17.28 270 top
R8  57.42,21.26 90 top
R9  57.42,25.24 270 top
R10  53.75,52.92 90 top
R11  51.74,52.93 90 top
R12  55.76,52.93 90 top
R13  67.8,60.3 0 top
R14  60.3,60.6 0 top
R17  52.62,25.21 270 top
R18  72.09,72.95 270 top
R19  74.39,73 270 top
R20  76.59,73.05 270 top
R21  55.07,25.26 90 top
R24  68.7,16.7 0 top
R25  43.95,3.6 90 top
R26  46.05,3.6 270 top
R27  68.7,14.6 180 top
R28  72.75,14.6 180 top
RLIM  50.03,37.59 180 top
RVD  47.53,16.34 270 top
TP1  60.6,3.75 0 top
TP4  49.8,3.6 0 top
U$1  58.46,59.28 0 bottom
U$2  59.24,88.19 180 top
U$3  34.33,50.59 90 top
U$4  47.76,51.43 0 top
U$5  48.02,33.09 0 top
U$6  25.9,80.55 270 top
U$7  45,44.99 90 top
U$8  53.32,17.86 90 top
U$9  75.25,87.5 180 top
U$10  72,8.9 180 top
U$11  45,45 0 top
VR1  55.5,3.45 90 top

### Tracks (layer width: path | path; a pad name or v marks a point on that pad's centre or on a via)
3V3  (via drill 0.3)  (8 unrouted)
  Top 0.152: CIN5.1 59.35,60.13 R14.1
  Top 0.2: v44.3,58.4 58.6,58.4 v58.7,58.3 | 66.81,53.6 v66.7,53.6 | 66.81,53.6 v67.2,53.6 | CIN5.1 59.35,54.25 60.05,53.55 66.76,53.55 66.81,53.6
  Top 0.305: U$7.P$55 U$7.P$54
  Route15 0.2: U$7.P$54 10.58,46.28 11.85,47.55 14.25,47.55 14.9,48.2 38.2,48.2 39.7,49.7 39.7,54 40.3,54.6 43.4,54.6 44.3,55.5 v44.3,58.4
  Route15 0.254: v44.3,58.4 v44.3,58.9 v44.3,65.14 v44.3,65.65 v44.3,83.55 44.3,83.8
  Bottom 0.2: U$1.3.3V@CAN1 60.51,84.41 60.5,84.4 56.79,84.4 55.59,85.6 46.03,85.6 44.74,84.32 44.44,84.05 v44.3,84.05 | v41,54.65 40.9,7.1 39.88,6.08 23.15,6.08 18.19,1.11
  Bottom 0.254: v44.3,65.14 v44.3,65.15 44.31,65.16 U$1.3.3V@MSP1
  other vias: 58.7,58.8 40.5,54.65
5V  (via drill 0.3)  (7 unrouted)
  Top 0.305: U$7.P$51 U$7.P$50
  Route15 0.2: U$7.P$50 11.8,42.5 | 11.8,42.5 | 11.8,42.5 13.87,42.5 14.2,42.8 14.2,42.81 42.63,42.81 43.32,43.5 44.1,43.5 v44.2,43.5 | 54.75,55.45 52.4,57.8 52.4,68.89 52.2,69.08 v52.2,84.25 | v54.65,11.7 52,8.95 v52,1.37 52,1.25
  Route15 0.254: v54.65,11.7 54.65,29.95 54.75,55.45
  Bottom 0.2: 70.2,16.7 v70.5,16.4 | 52.3,84.25 v52.2,84.25 51.28,84.25 U$1.5V | 51.91,1.27 v52,1.37 50.39,1.37 50.34,1.32 38.75,1.32 38.55,1.11 | v54.65,11.7 65.3,11.7 v70.5,16.9 | v44.2,43.5 v54.2,43.5 v54.7,43.5
  other vias: 55.15,11.7 51.5,1.37 51.7,84.25
ALCC  (via drill 0.3)  (2 unrouted)
  Top 0.2: 46.73,54.96 46.73,55.24 47.21,55.72
  Top 0.254: U$4.6 46.73,54.96 | 47.21,55.72 54.33,55.72 R12.2
  Route15 0.2: v46.75,55.4 v46.75,57.75 | v46.75,54.9 45.9,54.9 44.8,53.8 44.8,47.35 44.96,47.2 44.91,25.76 44.05,24.9 v44.05,11.5 v44.05,11
  Bottom 0.2: v46.75,57.75 47.05,58.05 52.25,58.05 52.27,58.03 U$1.P3.7_GPIO/PWM | v44.05,11 44.05,10.53 44.04,10.52 44.04,7.99 41.68,5.62 25.02,5.62 J5.3
BASE
  Top 0.305: Q1.1 R17.2 55.02,24.26 R21.1
BB_EN  (via drill 0.3)  (1 unrouted)
  Top 0.2: R21.2 55.5,26.64 v55.5,27.7 v55.5,28.2
  Route15 0.2: v55.5,28.2 60.1,32.8 v60.1,55.5 | v55.5,27.7 v55.5,14 v55.5,13.5
  Bottom 0.2: v60.1,55.5 59.71,55.11 U$1.P7.3_GPIO | 41.57,3.67 45.43,3.67 46.99,5.23 46.99,6.33 54.17,13.5 v55.5,13.5 | 41.57,3.67 41.55,3.65 | 41.57,3.67 33.23,3.67 J5.7
  other vias: 60.1,56
BT-NODE  (via drill 0.3)
  Top 0.305: R8.2 R9.2
  Top 0.508: R9.2 v58.79,24.29 v58.8,24.3 v59.3,24.3
  Bottom 0.508: U$6.P$3 83.05,43.55 63.8,24.3 v59.3,24.3
CANH  (via drill 0.3)
  Route15 0.2: U$7.P$53 13.86,46.26 15.2,47.6 38.4,47.6 40.3,49.5 40.3,53.6 40.7,54 44,54 45.4,55.4 v45.4,83.55 v45.4,84.05
  Bottom 0.2: 60.02,81.2 U$1.CANH 60,81.3 56.6,81.3 56.15,81.75 56.15,84.4 55.4,85.15 46.5,85.15 v45.4,84.05
CANL  (via drill 0.3)  (1 unrouted)
  Top 0.2: v40.8,82.4 57.01,82.4 v57.1,82.31
  Route15 0.2: U$7.P$57 38,48.8 39.2,49.9 39.2,54.3 40.8,55.9 v40.8,81.9 v40.8,82.4 40.5,82.5
  Bottom 0.2: v57.1,82.31 57.89,82.31 58.3,81.9 U$1.CANL
  other vias: 57.6,82.31
ENABLE
  Top 0.254: R6.1 47.89,26.91 48.5,26.3 48.5,25.23 Q1.3 48.52,23.98 49.3,23.2 49.3,19.6 49.7,19.2 50.13,19.2 U$8.P$7
  Top 0.305: 45.85,26.94 R6.1
FERRITE-BEAD  (via drill 0.3)  (3 unrouted)
  Top 0.152: CIN4.1 61.25,61.07 R14.2
  Route15 0.2: v62.6,60.9 62.6,63.3 63.2,63.9 v66.8,63.9
  Bottom 0.2: U$1.3.3V_ANALOG@MSP2 66.95,64.05 v66.8,63.9
  Bottom 0.254: U$1.3.3V_ANALOG@MSP2 67.27,65.18 67.29,65.16
  other vias: 62.6,60.4 66.3,63.9
GND  (via drill 0.3, 0.35)  (14 unrouted)
  Top 0.2: C3.2 47.46,22.56 v47.6,22.7
  Top 0.254: U$4.2 46.23,52.45 U$4.EXP 46.23,52.95 U$4.7 | 46.73,49.62 U$4.3 46.73,52.7 | RLIM.2 49.08,35.67 v49.64,35.11
  Top 0.305: C4.2 50.17,20.73 U$8.P$8 51.72,19.81 U$8.P$9 52.02,19.16 U$8.P$3 53.64,19.16 54.16,19.69 54.16,21.38 C2.2 | Q1.2 R17.1 | 46.73,49.62 CIN3.2 | 46.73,52.7 U$4.EXP
  Top 0.406: U$8.P$9 | U$9.P$5 69.25,86.35 v69.3,86.3 v69.3,85.7
  Bottom 0.305: U$7.P$22 U$7.P$25 10.66,30.94 | U$7.P$22 U$7.P$17 | U$7.P$27 U$7.P$22 | U$7.P$19 8.04,23.34 8.14,23.24 8.14,23.5 U$7.P$22 | U$7.P$24 5.58,26.03 | 5.58,26.03 U$7.P$27 | 5.58,26.03 5.58,25.85 8.09,23.34 | 8.09,23.34 8.09,23.33 | 8.09,23.34 8.09,23.39 8.1,23.4 | 10.66,30.94 U$7.P$30 | U$7.P$32 5.69,31.02 5.73,30.98 5.73,30.79 U$7.P$27 | 10.66,30.94 8.01,28.49 arc221 8.07,28.46
  Bottom 1.27: U$7.P$25 18.02,28.48 18.3,28.2 | U$7.P$17 13.5,23.4 17.4,27.3
  other vias: 49.64,33.91 49.64,34.51 45.74,52.91 46.34,52.91 46.94,52.91 46.04,52.31 46.64,52.31 47.24,52.31 51.6,39.9 51.6,39.3 74.55,14.9 74.55,14.3 58.05,2.7 58.05,2.1 43.65,5.4 44.25,5.4 69.45,62.7 69.45,62.1 58.6,62.9 58.6,62.4 62,58.8 62,58.3 47.1,22.7 30,18 33,18 36,18 36,15 33,15 30,15 30,12 33,12 36,12 36,9 33,9 30,9 30,21 33,21 36,21 24,21 24,18 24,15 24,12 24,9 27,9 27,12 27,15 21,12 21,9 18,9 18,12 27,36 27,39 24,39 24,36 21,36 21,39 18,39 18,36 27,45 30,45 18,45 51.7,19.6 51.7,19.1 51.7,18.6 51.7,18.1 52.4,26.9 52.9,26.9 57.2,26.9 57.7,26.9
  pour Route2: 40.24,-0.03 89.9,-0.08 89.99,89.38 40.13,89.96
  pour Bottom (rank 2, no thermals): 16.34,48.75 38.44,48.68 38.23,6.8 10.73,6.85 10.68,9.69 16.3,9.64
  pour Route2: 35.41,56.42 40.44,56.4 40.67,39.36 33.89,39.49 33.97,46.24
  pour Route2 (rank 2): 16.04,48.75 38.04,48.81 38.23,6.85 10.73,6.85 10.68,9.69 16.3,9.64
  pour Bottom: 11.86,9.65 18.23,9.55 17.79,9.11 12.27,9.11 12.23,9.07
  pour Bottom (isolate 0.61): 38.37,47.89 38.37,56.28 31.17,56.32 31.17,47.48 30.57,47.44 30.57,47.13 38.1,47.13
  pour Route2 (isolate 0.61): 38.37,47.89 38.37,56.28 31.3,56.46 31.3,47.63 30.57,47.44 30.57,47.13 38.1,47.13
  pour Route2: 40.55,6.15 10.7,6.15 10.65,0.05 41.55,0.05 41.5,5.35
  pour Bottom: 11.86,9.65 18.23,9.55 17.79,9.11 12.27,9.11 12.23,9.07
  pour Bottom (isolate 0.254, no thermals): 4.3,32.1 16.2,32.1 17,31.3 17,25 14.3,22.3 4.6,22.3 4.3,22.6 4.3,31.8
IN-OUT  (1 unrouted)
  Top 0.254: 45.62,51.23 45.5,51.23 | 45.5,51.23 38.12,51.23 37.52,50.63 34.37,50.63 U$3.P$1 | 43.5,25.05 43.5,16.65 44.75,15.4 RVD.2 | 45.5,51.23 45.5,49.92 CIN3.1
  Top 0.305: R11.1 51.8,51.92 51.8,48.1 51.69,47.99 | U$5.5 46.42,33.67 CIN.1 | U$5.3 46.38,34.67 CIN.1 | R10.1 53.75,48 53.73,47.99 | U$5.4 48.2,34.19 CIN.1 | U$7.P$28 U$7.P$23 U$7.P$26 | U$7.P$26 U$7.P$21 U$7.P$18 8.05,25.93 8.05,25.95 U$7.P$20 | U$7.P$26 U$7.P$29 | U$7.P$26 U$7.P$31 7.92,31.02 5.48,28.59 | RVD.2 48.23,15.19
  Top 0.406: R7.2 56.09,15.19 53.42,15.19 48.23,15.19
  Top 0.813: R12.1 55.76,50.01 53.75,48 | 53.73,47.99 51.91,47.99 51.8,48.1
  Top 1.016: U$3.P$1 34.31,50.58 34.31,48.82 35.14,47.99 41.73,47.99 | 41.73,47.99 51.69,47.99 | 45.89,34.17 CIN.1 45.82,34.27 41.73,34.27 | 41.73,47.99 41.73,34.27 | 41.73,34.27 41.73,26.82 43.5,25.05 45.78,25.05 R6.2
  pour Top (no thermals): 30.75,51.9 30.75,29.1 29.7,28.05 15.75,28.05 14.85,27.15 12.75,27.15 12,26.4 12,25.35 12.6,24.75 36.9,24.75 38.25,26.1 38.25,51.9
  pour Top (isolate 0.254, no thermals): 12.6,32.1 31.15,32.1 31.75,31.5 32.75,28.3 20.15,25.4 15.75,27.9 14.8,24.85 14.25,22.35 4.3,22.3 4.5,32
N$2  (via drill 2.5)
  other vias: 22.9,45
N$3
  Top 0.406: U$9.P$1 75.3,87.55
  Top 0.508: R20.1 76.59,80.21 75.3,81.5 75.3,87.45 U$9.P$1
N$4
  Top 0.305: R7.1 56.9,17.71 C1.1 54.39,16.79 U$8.P$1
N$5
  Top 0.305: U$8.P$2 54.62,18.51 C1.2 C2.1 57.03,20.7 R8.1
N$6
  Top 0.305: C3.1 47.52,20.09 47.54,18.48 | 47.54,18.48 RVD.1 | U$8.P$6 50.12,18.46 47.54,18.48
N$7  (via drill 0.3)
  other vias: 44.2,44
N$8
  Top 0.305: U$8.P$4 53.32,20.94 C4.1
N$9
  Top 0.305: 74.39,72.1 R19.2 | U$5.7 52.68,34.17 COUT.1 | U$5.8 52.19,34.67 COUT.1 | U$5.6 52.18,33.67 COUT.1
  Top 0.406: COUT.1 52.68,33.65
  Top 1.016: COUT.1 52.72,33.91 | R20.2 76.54,72.05 R19.2 74.34,72 R18.2 R5.2
  Top 1.27: COUT.1 70.07,33.87 74.4,38.2 74.4,71.94 74.34,72
N$10
  Top 0.305: U$5.10 50.98,35.68 RLIM.1
N$11
  Top 0.508: R19.1 74.39,80.21 73.7,80.9 73.7,87.45 U$9.P$2
N$12
  Top 0.508: R18.1 72.09,82.39 72.3,82.6 72.3,87.45 U$9.P$3
N$13  (via drill 1.6)
  other vias: 19.05,86.7
N$14  (via drill 0.3)  (1 unrouted)
  Route15 0.2: U$2.8 41.46,57.54 v41.45,57.5
  Bottom 0.2: U$1.P3.5_GPIO_DEBUG 52.83,57 42.95,57 42.45,57.5 v41.45,57.5
  other vias: 41.45,58
N$15  (via drill 0.3)  (1 unrouted)
  Route15 0.152: U$2.7 44,87.05 42.15,85 | 42.13,56.52 v42.15,56.5
  Route15 0.2: 42.15,85 42.15,58.55
  Route15 0.254: 42.15,58.55 42.13,58.36 42.13,56.52
  Bottom 0.152: v42.15,56.5 52.83,56.5 U$1.P3.4_GPIO_DEBUG
  other vias: 41.65,56.55
N$16  (via drill 2.5)
  other vias: 84.05,70.35
N$17
  Top 0.508: R5.1 69.84,82.24 70.7,83.1 70.7,87.45 U$9.P$4
N$18  (via drill 2.5)
  other vias: 84.05,36.52
N$19  (via drill 0.3)  (2 unrouted)
  Route15 0.152: v42.9,55.58 42.9,55.5
  Route15 0.2: v42.9,55.58 42.9,84.05 45.15,86.3 49.6,86.3 U$2.4
  Bottom 0.152: 42.95,55.53 v42.9,55.58
  other vias: 42.4,55.55
N$20  (via drill 0.3)  (1 unrouted)
  Route15 0.152: U$2.3 54,87.91 54,57.3 54.75,56.55 v54.75,56.4
  Bottom 0.152: v54.75,56.4 54.71,56.36 U$1.P2.0_TXD
  other vias: 54.75,56.95
N$21  (via drill 0.3)
  Route15 0.152: U$2.2 55.65,87.27 55.65,71.23 55.81,71.06 55.81,70.37 55.65,70.2 v55.65,57.6
  Bottom 0.152: v55.65,57.6 v55.65,57.1 55.65,55.95 55.2,55.5 55.2,53.69 U$1.SBWTDIO
N$22  (via drill 0.3)  (1 unrouted)
  Route15 0.152: U$2.SBWTCK 59.24,73.04 59.3,72.97 59.3,68.6 57.9,67.2 v57.9,56.25
  Bottom 0.152: v57.9,56.25 57.05,56.25 55.7,54.9 55.7,53.69 U$1.SBWTCK
  other vias: 57.4,56.25
N$23
  Top 0.254: U$10.2 72,11.6 71.4,12.2 68.7,12.2 | 68.7,12.2 67.8,13.1 67.8,14.55 R27.2 R24.1 | 60.49,3.86 59.9,4.45 VR1.3 55.48,6.3 47.55,6.3 46.05,4.8 R26.1 | 60.49,3.86 TP1.TP | 68.7,12.2 60.49,3.99 60.49,3.86
N$24
  Top 0.254: R25.1 R26.2 48.85,2.65 TP4.TP 49.95,3.45 VR1.2 54,1.95 54.75,1.2 61.95,1.2 63.46,2.71 U$10.3
N$25  (via drill 0.3)
  other vias: 47.25,57.75
N$26  (via drill 0.3)
  other vias: 30,39
N$27  (via drill 0.3)
  other vias: 30,36
N$28  (via drill 0.3)
  other vias: 18,33
N$29  (via drill 0.3)
  other vias: 21,33
N$30  (via drill 0.3)
  other vias: 24,33
N$31  (via drill 0.3)
  other vias: 27,33
N$32  (via drill 0.3)
  other vias: 30,33
N$33  (via drill 0.3)
  other vias: 21,15
N$34  (via drill 0.3)
  other vias: 15,9
N$35  (via drill 0.3)
  other vias: 12,9
OUT  (via drill 0.3)  (4 unrouted)
  Top 0.254: U$8.P$5 50.17,16.5 50.18,16.5 50.18,15.96
  Route15 0.2: v50.17,16.79 50.4,17.01 v50.4,59 v49.9,59 | v50.17,16.19 50.17,7.83 50.2,7.8 v50.2,7.7
  Bottom 0.2: v50.4,59 51.27,58.53 U$1.P1.6_GPIO/PWM | v50.2,7.7 49.01,7.7 47.45,6.14 47.45,5.05 45.5,3.1 35.46,3.1 33.47,1.11
  other vias: 49.7,7.7
SCL  (via drill 0.3)  (3 unrouted)
  Top 0.254: U$4.4 v48.74,51.35
  Top 0.305: v48.74,51.35 49.16,51.83 48.84,51.35 50.46,53.78 51.65,53.78 R11.2
  Route15 0.2: 48.95,61.15 48.95,55.78 49.41,55.32 49.41,52.11 v49.05,51.75 49.05,35.45 48.98,35.38 48.98,26.18 45.95,23.15 v45.95,7.8 v45.95,7.3 45.95,7.25 45.9,7.2 | v48.95,61.2 v49.45,61.2
  Bottom 0.2: U$1.P5.1_I2C-SCL-1 52.65,60.03 52.64,60.03 51.24,60.03 50.72,60.58 50.59,60.71 50.47,60.85 50.46,60.85 50.28,60.85 50.09,60.86 49.45,60.88 v49.45,61.2 | v45.95,7.3 45.95,4.9 45.17,4.12 31.4,4.12 J5.6
SDA  (via drill 0.3)  (4 unrouted)
  Top 0.254: U$4.5 48.21,55.07 48.26,55.07 53.26,55.07 53.75,54.59 R10.2
  Top 0.305: 48.91,55.06 48.84,55.08 48.87,55.08
  Route15 0.2: v48.25,60.45 v48.25,59.95 v48.25,55.05 48.25,51.78 47.64,51.17 47.64,27.69 44.7,24.6 v44.7,10.25 v44.7,9.7
  Bottom 0.2: v48.25,60.45 50.27,60.4 51.06,59.55 52.74,59.55 U$1.P5.0_I2C-SDA-1 | v44.7,9.7 44.7,9.33 44.64,9.27 44.64,7.94 41.73,5.03 27.23,5.03 23.31,1.11
  other vias: 48.75,55.05
SYNC1  (via drill 0.3)  (1 unrouted)
  Route15 0.2: U$7.P$45 14.38,42.35 v43.4,42.35
  Bottom 0.2: v43.4,42.35 43.4,49.2 45,50.8 57.3,50.8 58.3,51.8 59.6,51.8 60.21,52.41 U$1.P7.2_SYNC1
  other vias: 43.4,41.85
SYNC2  (via drill 0.3)  (1 unrouted)
  Route15 0.2: U$7.P$49 16.49,47.1 44.2,47.1 44.3,47 v44.2,46.92
  Bottom 0.2: v44.2,46.92 47.72,50.35 57.49,50.35 58.49,51.35 59.89,51.35 60.72,52.13 60.72,53.53 U$1.PJ.3_SYNC2
  other vias: 44.2,46.42
TOVER  (via drill 0.3)  (3 unrouted)
  Top 0.254: R4.2 47.25,37.85 47.25,35.55 47.63,35.17 U$5.2
  Route15 0.2: v56.6,42.05 56.6,44 v56.55,59.05 | v48.3,39.4 48.3,27 45.3,24 v45.3,9 v45.3,8.5
  Bottom 0.2: v48.3,39.9 50.45,42.05 v56.6,42.05 | U$1.P1.7_GPIO/PWM 56.33,59.03 v56.55,59.05 v56.55,59.55 | v45.3,8.5 45.3,8.08 45.29,8.07 45.29,4.89 44.98,4.58 29.06,4.58 J5.5
  other vias: 56.6,42.6
V-BATT  (via drill 0.3, 2.7)  (2 unrouted)
  Top 0.254: U$3.P$2 34.33,55.37 36.3,53.4 44,53.4 44.6,54 45.69,54 45.73,54.04
  Top 0.61: 24.6,58.02 24.54,58.08
  Bottom 0.813: 24.99,77.95 24.99,77.88 29.24,77.88 | 24.99,72.74 29.24,72.74
  other vias: 23.7,87 34.5,87 21,84 18,84 24,84 27,84 27,81 24,81 21,81 18,81 18,78 21,78 24,78 27,78 27,75 24,75 21,75 18,75 27,72 24,72 21,72 18,72 18,69 18,66 18,63 21,69 24,69 27,69 27,66 24,66 21,66 21,63 24,63 27,63 27,60 24,60 21,60 18,60 21.75,54.75 21.75,51.75 25.5,51.75 25.5,54.75 28.5,57 28.5,54 28.5,51 27,57.75 24,57.75 21,57.75 33,84 36,84 36,81 33,81 33,78 36,78 36,75 33,75 33,72 36,72 36,69 33,69 33,66 36,66 36,63 33,63
  pour Top (no thermals): 29.61,49.99 29.61,89.66 16.69,89.66 16.69,49.58 29.57,49.58 29.57,49.77
  pour Top (no thermals): 37.89,57.53 37.99,89.96 30.89,89.95 30.89,57.54 37.35,57.54
  pour Bottom (isolate 0.254, no thermals): 29.61,49.99 29.61,89.06 16.69,89.06 16.69,49.58 29.57,49.58 29.57,49.77
  pour Bottom: 37.89,57.53 37.99,89.96 30.89,89.95 30.89,57.54 37.35,57.54
VTEMP  (via drill 0.3)  (2 unrouted)
  Top 0.2: R28.2 72,14.8 v72,16.3 v72,16.8
  Top 0.254: R28.2 R27.1
  Route15 0.2: v69.45,60.1 72,57.55 v72,16.8
  Bottom 0.2: v72,16.3 66.1,10.4 54.7,10.4 50.6,6.3 48.8,6.3 47.9,5.4 47.9,4.86 45.69,2.65 37.4,2.65 36.38,1.63 J5.9
  other vias: 69.45,60.6
VTEMP_FILTERED  (via drill 0.3)  (2 unrouted)
  Top 0.152: CIN7.1 R13.1
  Bottom 0.152: U$1.P1.0_A0 65.67,63.03 v66.1,62.6
  Bottom 0.254: 64.07,63.04 U$1.P1.0_A0
  other vias: 66.1,62.1

### Text on the board
tSilk: HuskySat | Battery Board | V4 | IN-OUT | IN-OUT | ALCC | SDA | SCL | ADC | out | CB-EN | LDO-EN | TRIP-TEST | LDO | HEAT | TPS709 | GND
_tsilk: V-TEMP | T-under
_bsilk: GND | 3v3 | ALCC | SDA | Tover | SCL | BB_EN | OUT | VTEMP | 5v